# Altium schematic sheet LFR_Body_Circuit.schdoc
size 298 x 213 mm
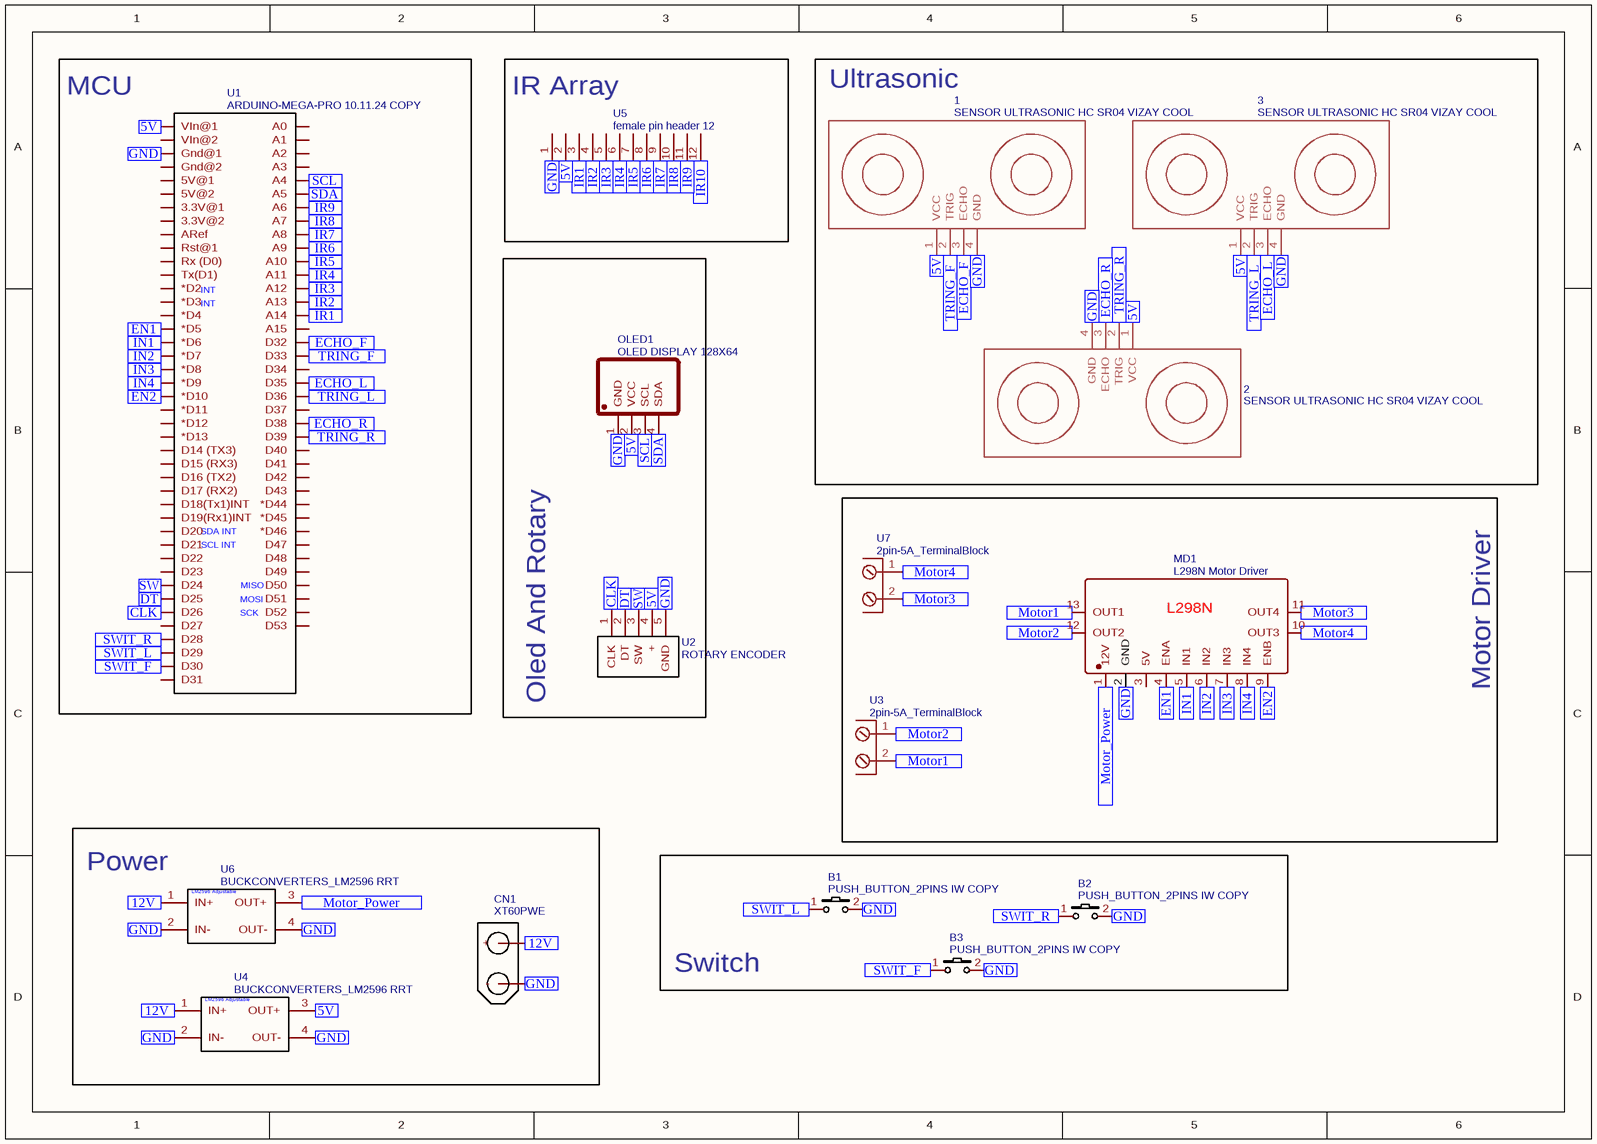
[diagram p0: LFR_Body_Circuit.schdoc]

## Parts
1  SENSOR ULTRASONIC HC SR04 VIZAY COOL  [ULTRASONIC-HC-SR04]
2  SENSOR ULTRASONIC HC SR04 VIZAY COOL  [ULTRASONIC-HC-SR04]
3  SENSOR ULTRASONIC HC SR04 VIZAY COOL  [ULTRASONIC-HC-SR04]
B1  PUSH_BUTTON_2PINS IW COPY  [R 5W COPY COPY COPY COPY COPY]
B2  PUSH_BUTTON_2PINS IW COPY  [R 5W COPY COPY COPY COPY COPY]
B3  PUSH_BUTTON_2PINS IW COPY  [R 5W COPY COPY COPY COPY COPY]
CN1  XT60PWE  [CONN-TH_XT60UPB-M COPY]
MD1  L298N Motor Driver  [L298N MOTOR DRIVER]
OLED1  OLED DISPLAY 128X64  [0.96-OLED-DISPLAY]
U1  ARDUINO-MEGA-PRO 10.11.24 COPY  [ARDUINO-MEGA-PRO-MINI]
U2  ROTARY ENCODER  [ROTARYENCODER]
U3  2pin-5A_TerminalBlock  [5A_2PIN-TERMINALBLOCK]
U4  BUCKCONVERTERS_LM2596 RRT  [LM2596:YAAJ_DCDC_STEPDOWN_LM2596]
U5  female pin header 12  [FEMALE PIN HEADER 12PIN]
U6  BUCKCONVERTERS_LM2596 RRT  [LM2596:YAAJ_DCDC_STEPDOWN_LM2596]
U7  2pin-5A_TerminalBlock  [5A_2PIN-TERMINALBLOCK]

## Blocks framed on the sheet
MCU: U1
IR Array: U5
Ultrasonic: 1-3
Oled And Rotary: OLED1 U2
Power: CN1 U4 U6
Switch: B1-B3

## Ports
5V (in), 12V (in), CLK (in), DT (in), ECHO_F (in), ECHO_L (in), ECHO_R (in), EN1 (in), EN2 (in), GND (in), IN1 (in), IN2 (in), IN3 (in), IN4 (in), IR1 (in), IR2 (in), IR3 (in), IR4 (in), IR5 (in), IR6 (in), IR7 (in), IR8 (in), IR9 (in), IR10 (in), Motor1 (in), Motor2 (in), Motor3 (in), Motor4 (in), Motor_Power (in), SCL (in), SDA (in), SW (in), SWIT_F (in), SWIT_L (in), SWIT_R (in), TRING_F (in), TRING_L (in), TRING_R (in)

## Nets
5V: 1.1(VCC) 2.1(VCC) 3.1(VCC) U1.1(VIn@1) U4.3(OUT+) U5.2 ; port 5V
12V: CN1.1(+) U4.1(IN+) U6.1(IN+) ; port 12V
CLK: U1.37(D26) ; port CLK
DT: U1.36(D25) ; port DT
ECHO_F: 1.3(ECHO) U1.59(D32) ; port ECHO_F
ECHO_L: 3.3(ECHO) U1.62(D35) ; port ECHO_L
ECHO_R: 2.3(ECHO) U1.65(D38) ; port ECHO_R
EN1: MD1.4(ENA) U1.16(*D5) ; port EN1
EN2: MD1.9(ENB) U1.21(*D10) ; port EN2
GND: 1.4(GND) 2.4(GND) 3.4(GND) B1.2 B2.2 B3.2 CN1.2(-) MD1.2(GND) U1.3(Gnd@1) U4.2(IN-) U4.4(OUT-) U5.1 U6.2(IN-) U6.4(OUT-) ; port GND
IN1: MD1.5(IN1) U1.17(*D6) ; port IN1
IN2: MD1.6(IN2) U1.18(*D7) ; port IN2
IN3: MD1.7(IN3) U1.19(*D8) ; port IN3
IN4: MD1.8(IN4) U1.20(*D9) ; port IN4
IR1: U1.57(A14) U5.3 ; port IR1
IR2: U1.56(A13) U5.4 ; port IR2
IR3: U1.55(A12) U5.5 ; port IR3
IR4: U1.54(A11) U5.6 ; port IR4
IR5: U1.53(A10) U5.7 ; port IR5
IR6: U1.52(A9) U5.8 ; port IR6
IR7: U1.51(A8) U5.9 ; port IR7
IR8: U1.50(A7) U5.10 ; port IR8
IR9: U1.49(A6) U5.11 ; port IR9
IR10: U5.12 ; port IR10
Motor1: MD1.13(OUT1) U3.2 ; port Motor1
Motor2: MD1.12(OUT2) U3.1 ; port Motor2
Motor3: MD1.11(OUT4) U7.2 ; port Motor3
Motor4: MD1.10(OUT3) U7.1 ; port Motor4
Motor_Power: MD1.1(12V) U6.3(OUT+) ; port Motor_Power
SCL: U1.47(A4) ; port SCL
SDA: U1.48(A5) ; port SDA
SW: U1.35(D24) ; port SW
SWIT_F: B3.1 U1.41(D30) ; port SWIT_F
SWIT_L: B1.1 U1.40(D29) ; port SWIT_L
SWIT_R: B2.1 U1.39(D28) ; port SWIT_R
TRING_F: 1.2(TRIG) U1.60(D33) ; port TRING_F
TRING_L: 3.2(TRIG) U1.63(D36) ; port TRING_L
TRING_R: 2.2(TRIG) U1.66(D39) ; port TRING_R

Not connected (* = marked no-connect by the designer): MD1 3(5V); OLED1 1(GND) 2(VCC) 3(SCL) 4(SDA); U1 2(VIn@2) 4(Gnd@2) 5(5V@1) 6(5V@2) 7(3.3V@1) 8(3.3V@2) 9(ARef) 10(Rst@1) 11(Rx_(D0)) 12(Tx(D1)) 13(*D2) 14(*D3) 15(*D4) 22(*D11) 23(*D12) 24(*D13) 25(D14_(TX3)) 26(D15_(RX3)) 27(D16_(TX2)) 28(D17_(RX2)) 29(D18(Tx1)INT) 30(D19(Rx1)INT) 31(D20) 32(D21) 33(D22) 34(D23) 38(D27) 42(D31) 43(A0) 44(A1) 45(A2) 46(A3) 58(A15) 61(D34) 64(D37) 67(D40) 68(D41) 69(D42) 70(D43) 71(*D44) 72(*D45) 73(*D46) 74(D47) 75(D48) 76(D49) 77(D50) 78(D51) 79(D52) 80(D53); U2 1(CLK) 2(DT) 3(SW) 4(+) 5(GND)

## Notes on the sheet
- Motor Driver
- (in symbol ARDUINO-MEGA-PRO 10.11.24 COPY) INT; SDA INT; SCL INT; MISO; MOSI; SCK
- (in symbol BUCKCONVERTERS_LM2596 RRT) LM2596 Adjustable
- (in symbol L298N Motor Driver) L298N

## Library data of the parts
1-3 = SENSOR ULTRASONIC HC SR04 VIZAY COOL: Contributor: hollandacocobear; spicePre: ?; spiceSymbolName: SENSOR ULTRASONIC HC SR04 VIZAY COOL
B1-B3 = PUSH_BUTTON_2PINS IW COPY: Manufacturer Part: PUSH_BUTTON_2Pini; Contributor: MinnKhantKyaw; spicePre: B; spiceSymbolName: PUSH_BUTTON_2PINS IW COPY
CN1 = XT60PWE: Manufacturer: Changzhou Amass Elec; nameAlias: Value; Supplier: LCSC; Supplier Part: C98732; Manufacturer Part: XT60PWE; spicePre: C; spiceSymbolName: XT60 COPY COPY
MD1 = L298N Motor Driver: Contributor: KC; spicePre: M; spiceSymbolName: L298N Motor Driver
OLED1 = OLED DISPLAY 128X64: Contributor: iloveelectronics; spicePre: O; spiceSymbolName: OLED DISPLAY 128X64
U1 = ARDUINO-MEGA-PRO 10.11.24 COPY: Manufacturer Part: ARDUINO MEGA 2560 PRO EMBED; subpart_no: 1; Contributor: Tony Sloos; spicePre: U; spiceSymbolName: ARDUINO-MEGA-PRO 10.11.24 COPY
U2 = ROTARY ENCODER: Contributor: ugursefayalcindag; spicePre: U; spiceSymbolName: ROTARY ENCODER
U3 U7 = 2pin-5A_TerminalBlock: Contributor: Christel_Peeris; spicePre: U; spiceSymbolName: 2pin-5A_TerminalBlock
U4 U6 = BUCKCONVERTERS_LM2596 RRT: Symbol: BuckConverters_LM2596_Adj; Description: Servo 5V; Add into BOM: yes; Origin Footprint: YAAJ_DCDC_StepDown_LM2596; Contributor: dirasuryakadek; Device: BuckConverters_LM2596_Adj; Convert to PCB: yes; spicePre: U; spiceSymbolName: BuckConverters_LM2596_Adj
U5 = female pin header 12: Manufacturer Part: New SchematicLib; Contributor: zsteva; spicePre: U; spiceSymbolName: female pin header 12